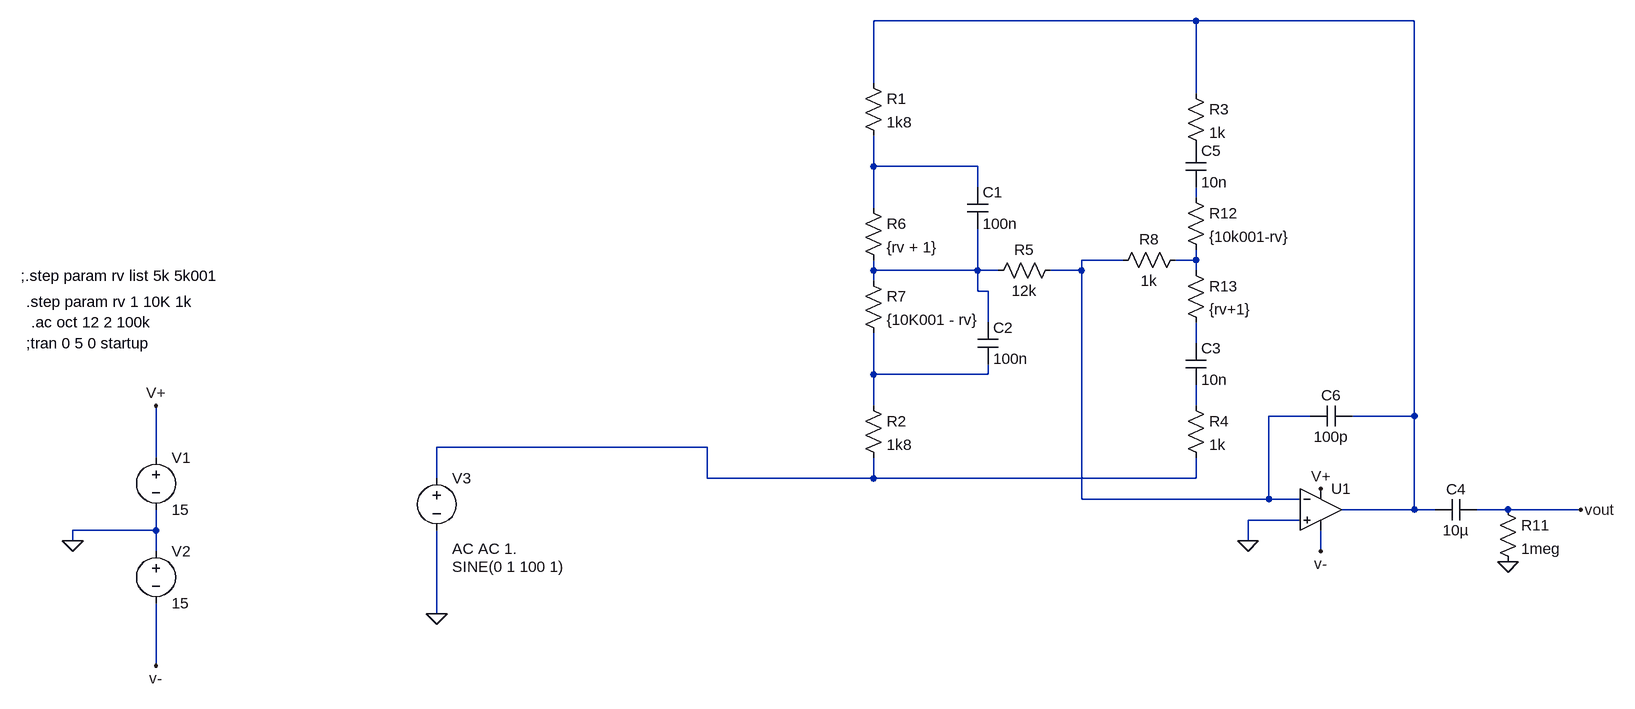
[diagram p0: schematic self-baxandall.asc]
self-baxandall.asc, the LTspice schematic file:
Version 4
SHEET 1 1820 868
WIRE 1152 -576 656 -576
WIRE 1488 -576 1152 -576
WIRE 656 -480 656 -576
WIRE 1152 -464 1152 -576
WIRE 656 -352 656 -400
WIRE 816 -352 656 -352
WIRE 816 -320 816 -352
WIRE 1152 -304 1152 -320
WIRE 656 -288 656 -352
WIRE 1040 -208 976 -208
WIRE 1152 -208 1152 -224
WIRE 1152 -208 1120 -208
WIRE 656 -192 656 -208
WIRE 816 -192 816 -256
WIRE 816 -192 656 -192
WIRE 848 -192 816 -192
WIRE 976 -192 976 -208
WIRE 976 -192 928 -192
WIRE 1152 -192 1152 -208
WIRE 656 -176 656 -192
WIRE 816 -160 816 -192
WIRE 832 -160 816 -160
WIRE 832 -112 832 -160
WIRE 1152 -80 1152 -112
WIRE 656 -32 656 -96
WIRE 832 -32 832 -48
WIRE 832 -32 656 -32
WIRE 656 16 656 -32
WIRE 1152 16 1152 -16
WIRE 1328 32 1264 32
WIRE 1488 32 1488 -576
WIRE 1488 32 1392 32
WIRE 400 80 -16 80
WIRE -448 96 -448 16
WIRE -16 128 -16 80
WIRE 400 128 400 80
WIRE 656 128 656 96
WIRE 656 128 400 128
WIRE 1152 128 1152 96
WIRE 1152 128 656 128
WIRE 976 160 976 -192
WIRE 1264 160 1264 32
WIRE 1264 160 976 160
WIRE 1312 160 1264 160
WIRE 1488 176 1488 32
WIRE 1488 176 1376 176
WIRE 1520 176 1488 176
WIRE 1632 176 1584 176
WIRE 1744 176 1632 176
WIRE 1312 192 1232 192
WIRE -448 208 -448 176
WIRE -448 208 -576 208
WIRE -576 224 -576 208
WIRE 1232 224 1232 192
WIRE -448 240 -448 208
WIRE 1344 240 1344 208
WIRE -16 336 -16 208
WIRE -448 416 -448 320
FLAG -576 224 0
FLAG -16 336 0
FLAG -448 16 V+
FLAG 1344 144 V+
FLAG 1744 176 vout
FLAG 1632 256 0
FLAG -448 416 v-
FLAG 1344 240 v-
FLAG 1232 224 0
SYMBOL voltage -448 80 R0
WINDOW 123 0 0 Left 2
WINDOW 39 0 0 Left 2
SYMATTR InstName V1
SYMATTR Value 15
SYMBOL voltage -16 112 R0
WINDOW 3 24 152 Left 2
WINDOW 123 24 124 Left 2
WINDOW 39 0 0 Left 2
SYMATTR Value SINE(0 1 100 1)
SYMATTR Value2 AC AC 1.
SYMATTR InstName V3
SYMBOL Opamps\\UniversalOpamp2 1344 176 R0
SYMATTR InstName U1
SYMBOL res 640 -304 R0
SYMATTR InstName R6
SYMATTR Value {rv + 1}
SYMBOL res 640 -192 R0
SYMATTR InstName R7
SYMATTR Value {10K001 - rv}
SYMBOL cap 1584 160 R90
WINDOW 0 0 32 VBottom 2
WINDOW 3 32 32 VTop 2
SYMATTR InstName C4
SYMATTR Value 10µ
SYMBOL res 1616 160 R0
SYMATTR InstName R11
SYMATTR Value 1meg
SYMBOL res 1136 -320 R0
SYMATTR InstName R12
SYMATTR Value {10k001-rv}
SYMBOL res 1136 -208 R0
SYMATTR InstName R13
SYMATTR Value {rv+1}
SYMBOL voltage -448 224 R0
WINDOW 123 0 0 Left 2
WINDOW 39 0 0 Left 2
SYMATTR InstName V2
SYMATTR Value 15
SYMBOL cap 800 -320 R0
SYMATTR InstName C1
SYMATTR Value 100n
SYMBOL cap 816 -112 R0
SYMATTR InstName C2
SYMATTR Value 100n
SYMBOL res 640 -496 R0
SYMATTR InstName R1
SYMATTR Value 1k8
SYMBOL res 640 0 R0
SYMATTR InstName R2
SYMATTR Value 1k8
SYMBOL res 1136 -480 R0
SYMATTR InstName R3
SYMATTR Value 1k
SYMBOL res 1136 0 R0
SYMATTR InstName R4
SYMATTR Value 1k
SYMBOL cap 1136 -80 R0
SYMATTR InstName C3
SYMATTR Value 10n
SYMBOL cap 1136 -384 R0
SYMATTR InstName C5
SYMATTR Value 10n
SYMBOL res 944 -208 R90
WINDOW 0 0 56 VBottom 2
WINDOW 3 32 56 VTop 2
SYMATTR InstName R5
SYMATTR Value 12k
SYMBOL res 1136 -224 R90
WINDOW 0 0 56 VBottom 2
WINDOW 3 32 56 VTop 2
SYMATTR InstName R8
SYMATTR Value 1k
SYMBOL cap 1392 16 R90
WINDOW 0 0 32 VBottom 2
WINDOW 3 32 32 VTop 2
SYMATTR InstName C6
SYMATTR Value 100p
TEXT -648 -80 Left 2 !;tran 0 5 0 startup
TEXT -640 -112 Left 2 !.ac oct 12 2 100k
TEXT -648 -144 Left 2 !.step param rv 1 10K 1k
TEXT -656 -184 Left 2 !;.step param rv list 5k 5k001

The netlist it stands for:
* self-baxandall.asc
V1 V+ 0 15
V3 N010 0 SINE(0 1 100 1) AC AC 1.
XU1 0 N004 V+ v- N001 level.2 Avol=1Meg GBW=10Meg Slew=10Meg ilimit=25m rail=0 Vos=0 phimargin=45 en=0 enk=0 in=0 ink=0 Rin=500Meg  ; pins IN+ IN- V+ V- OUT
R6 N002 N006 {rv + 1}
R7 N006 N008 {10K001 - rv}
C4 vout N001 10µ
R11 vout 0 1meg
R12 N003 N005 {10k001-rv}
R13 N005 N007 {rv+1}
V2 0 v- 15
C1 N002 N006 100n
C2 N006 N008 100n
R1 N001 N002 1k8
R2 N008 N010 1k8
R3 N001 P001 1k
R4 N009 N010 1k
C3 N007 N009 10n
C5 P001 N003 10n
R5 N004 N006 12k
R8 N005 N004 1k
C6 N001 N004 100p
;tran 0 5 0 startup
.ac oct 12 2 100k
.step param rv 1 10K 1k
;.step param rv list 5k 5k001
.lib UniversalOpamps2.sub
.backanno
.end